# Altium schematic sheet USBserial.SchDoc
size A4
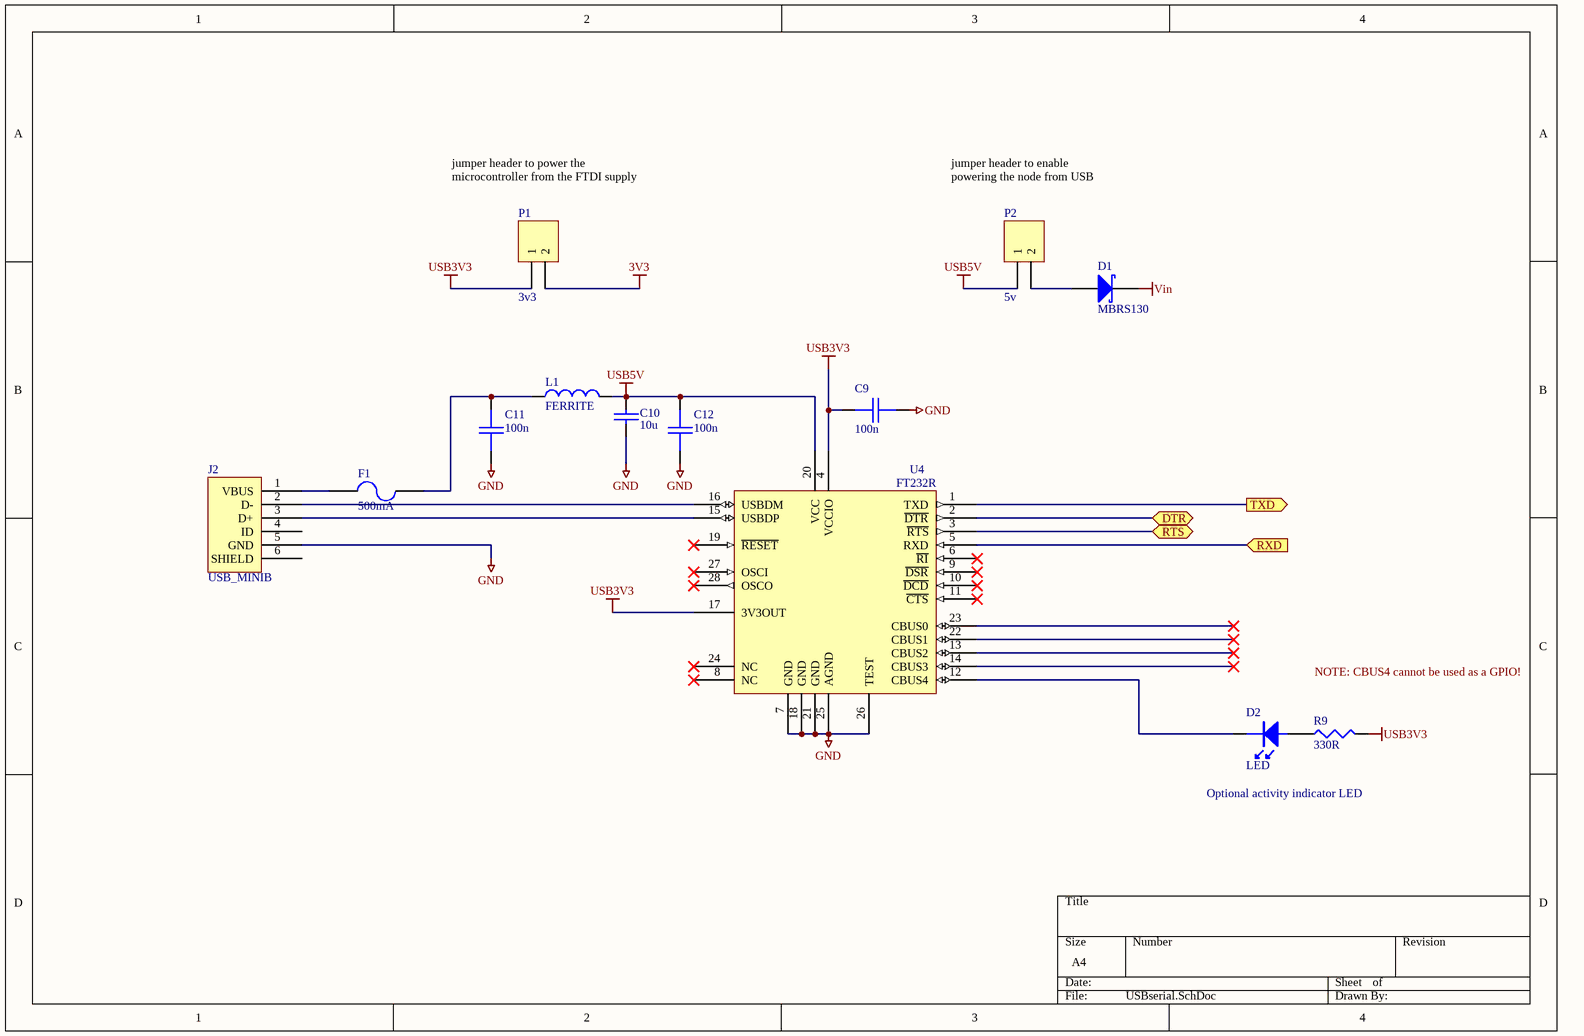
[diagram p0: USBserial.SchDoc]

## Parts
C9  100n  [0603]
C10  10u  [0805]
C11  100n  [0603]
C12  100n  [0603]
D1  MBRS130  [SMB]
D2  LED  [0805LED]
F1  500mA  [1812]
J2  USB_MINIB  [USB_MINIB_UX60SC]
L1  FERRITE  [0805]
P1  3v3  [HDR1X2]
P2  5v  [HDR1X2]
R9  330R  [0603]
U4  FT232R  [SSOP28w]

## Ports
DTR, RTS, RXD (in), TXD (out)

## Nets
3V3: P1.2
GND: C9.2 C10.1 C11.2 C12.2 J2.5(GND) U4.7(GND) U4.18(GND) U4.21(GND) U4.25(AGND) U4.26(TEST)
USB3V3: C9.1 P1.1 R9.2 U4.4(VCCIO) U4.17(3V3OUT)
USB5V: C10.2 C12.1 L1.2 P2.1 U4.20(VCC)
Vin: D1.K
DTR: U4.2(~{DTR}) ; port DTR
RTS: U4.3(~{RTS}) ; port RTS
RXD: U4.5(RXD) ; port RXD
TXD: U4.1(TXD) ; port TXD
NetC11_1: C11.1 F1.2 L1.1
NetD1_A: D1.A P2.2
NetD2_A: D2.A R9.1
NetD2_K: D2.K U4.12(CBUS4)
NetF1_1: F1.1 J2.1(VBUS)
NetJ2_2: J2.2(D-) U4.16(USBDM)
NetJ2_3: J2.3(D+) U4.15(USBDP)

Not connected (* = marked no-connect by the designer): J2 4(ID) 6(SHIELD); U4 6(~{RI})* 8(NC)* 9(~{DSR})* 10(~{DCD})* 11(~{CTS})* 13(CBUS2)* 14(CBUS3)* 19(~{RESET})* 22(CBUS1)* 23(CBUS0)* 24(NC)* 27(OSCI)* 28(OSCO)*

## Notes on the sheet
- jumper header to power the microcontroller from the FTDI supply
- jumper header to enable powering the node from USB
- NOTE: CBUS4 cannot be used as a GPIO!
- Optional activity indicator LED

## Library data of the parts
C9-C12 = CAP: Capacitor
  C9 C11 C12: Element14: 9406140; Element14 Price: 0.13
  C10: Element14: 1458902RL; Element14 Price: 0.69
D1 = D SCHOTTKY: Schottky Diode; Revision: July-2002: Re-released for DXP Platform.; Element14: 9556931; Element14 Price: 0.43; Digikey: MBRS130LT3GOSCT-ND; Digikey Price: 0.311
F1 = FUSE2: Fuse; Element14 Price: 4.60 (min 10); Element14 (low stock): 9943625(holder+fuse); Digikey: F1301CT-ND(holder+fuse); Digikey Price: 3.96
J2 = USB_miniB_SMT: USB Mini B Connector; Element14: 9786473; Element14 Price: $3.08
L1 = INDUCTOR: Manufacturer: Generic Components; Revision: July-2002: Re-released for DXP Platform.; Element14: 1308773; Element14 Price: 0.72
P1 P2 = Header 2: Header, 2-Pin; LatestRevisionDate: 17-Jul-2002; LatestRevisionNote: Re-released for DXP Platform.; Publisher: Altium Limited
R9 = RES1: Resistor